# EAGLE design Hooly_2.023 (EAGLE 8.5.1)
SHT31 con connettore Tutto 1206 anzichè 0603 Con regolatore all'ingresso Variante Con quarzo non SMD Partitore a VBATT per misurare livello batteria
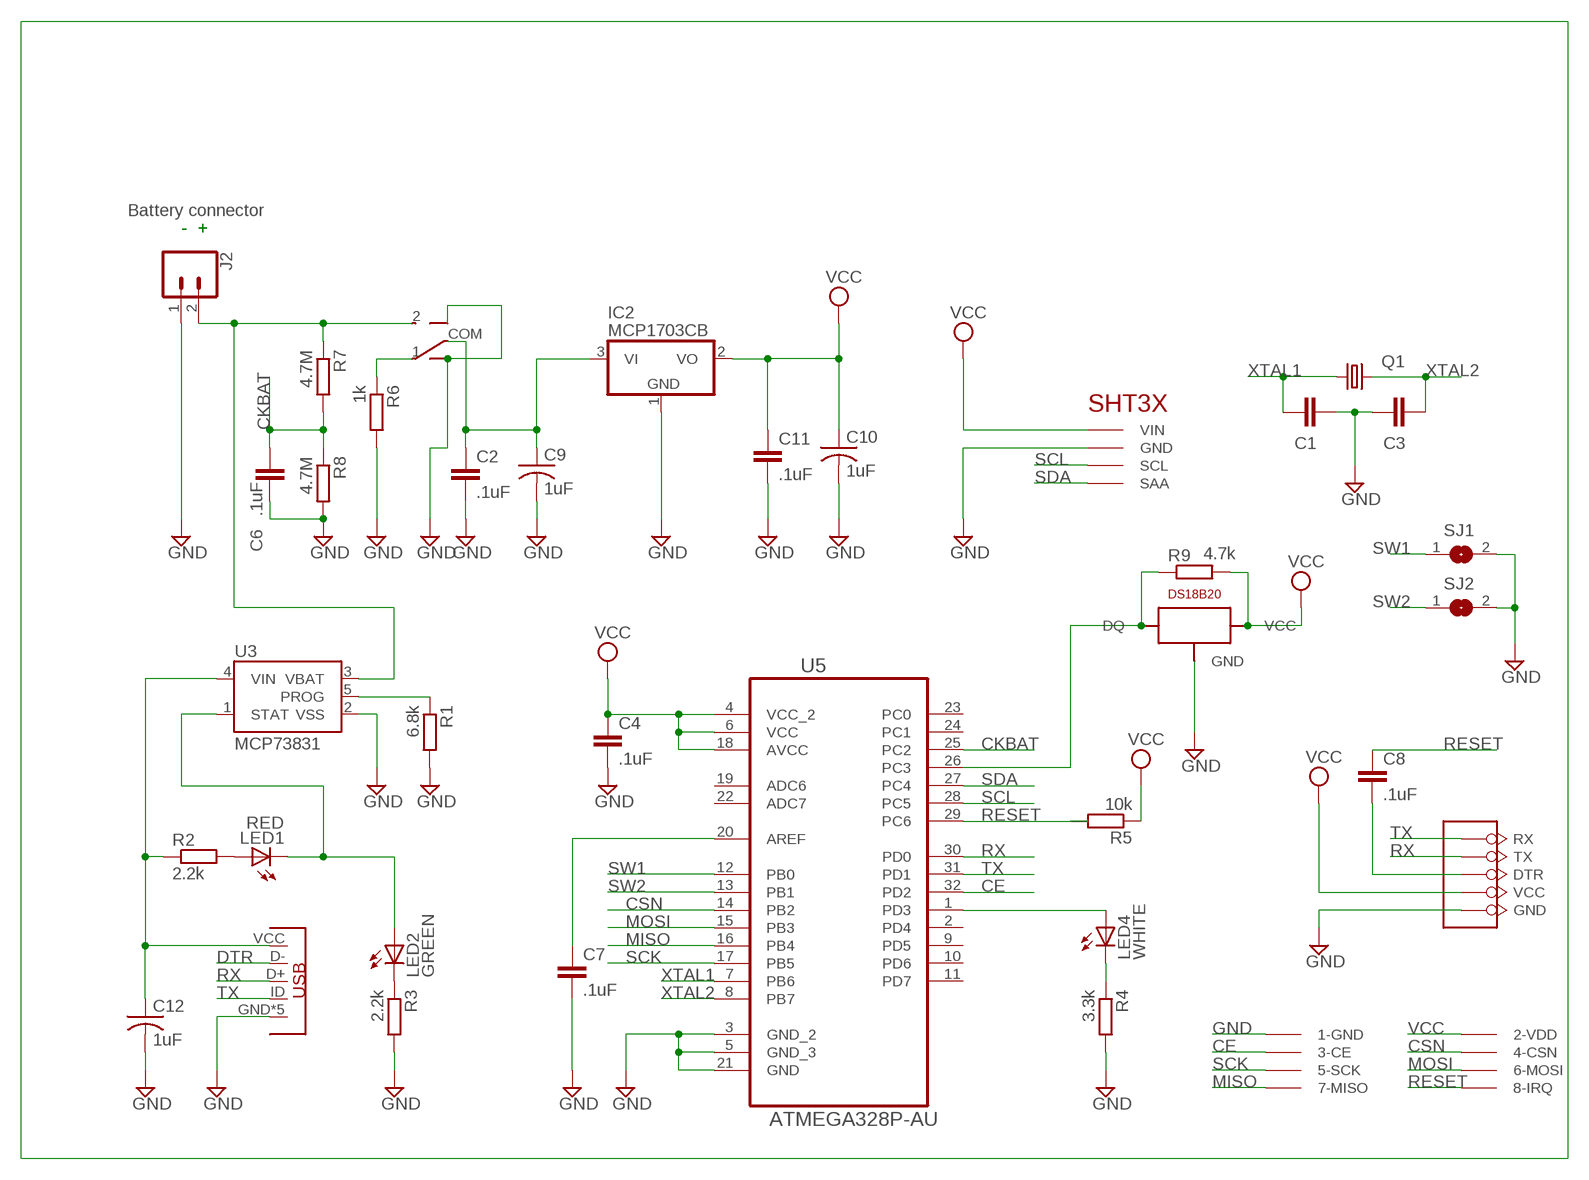
[diagram p0: schematic, sheet 1]

## Parts
C1  C-EUC0603K  [C0603K]
C2  .1uF  C-EUC0603  [C0603]
C3  C-EUC0603K  [C0603K]
C4  .1uF  C-EUC0603  [C0603]
C6  .1uF  C-EUC0603  [C0603]
C7  .1uF  C-EUC0603  [C0603]
C8  .1uF  C-EUC0603  [C0603]
C9  1uF  C-USC1206K  [C1206K]
C10  1uF  C-USC1206K  [C1206K]
C11  .1uF  C-EUC0603  [C0603]
C12  1uF  C-USC1206K  [C1206K]
IC2  MCP1703CB  [SOT23]
J2  CONN_02  [1X02]
LED1  RED  LEDCHIPLED_0603  [CHIPLED_0603]
LED2  GREEN  LEDCHIPLED_0603  [CHIPLED_0603]
LED4  WHITE  LEDCHIPLED_0603  [CHIPLED_0603]
Q1  KX-9B  [5.0X3.2_2]
R1  6.8k  R-EU_R0603  [R0603]
R2  2.2k  R-EU_R0603  [R0603]
R3  2.2k  R-EU_R0603  [R0603]
R4  3.3k  R-EU_R0603  [R0603]
R5  10k  R-EU_R0603  [R0603]
R6  1k  R-EU_R0603  [R0603]
R7  4.7M  R-EU_R0603  [R0603]
R8  4.7M  R-EU_R0603  [R0603]
R9  4.7k  R-EU_R0603  [R0603]
SJ1  SJ  [SJ]
SJ2  SJ  [SJ]
U3  MCP73831  [SOT23-5]
U5  ATMEGA328P-AU  [QFP80P900X900X120-32N]
U$1  SHT3XLARGE  [MYSHT3X]
U$2  MYSWITCH2MM  [MYSWITCH]
U$3  MYDS18B20  [MYDS18B20]
U$4  MYNRF24L01SOCKET  [MYNRF24L01SOCKET]
U$5  FTDI232  [FTDI232]
U$7  MYMICROUSB  [MYMICROUSB]

## Nets
CE: U5.32(PD2) U$4.CE(3-CE)
CKBAT: C6.1 R7.2 R8.1 U5.25(PC2)
CSN: U5.14(PB2) U$4.CSN(4-CSN)
DTR: C8.2 U$5.DTR U$7.D-
GND: C1.2 C2.2 C3.1 C4.2 C6.2 C7.2 C9.2 C10.2 C11.2 C12.2 IC2.1(GND) J2.1 R1.2 R3.2 R4.2 R6.2 R8.2 SJ1.2 SJ2.2 U3.2(VSS) U5.3(GND_2) U5.5(GND_3) U5.21(GND) U$1.GND U$2.GND1 U$2.GND2 U$3.GND U$4.GND(1-GND) U$5.GND U$7.GND U$7.P$6(GND) U$7.P$7(GND) U$7.P$8(GND) U$7.P$9(GND)
MISO: U5.16(PB4) U$4.MISO(7-MISO)
MOSI: U5.15(PB3) U$4.MOSI(6-MOSI)
N$2: C2.1 C9.1 IC2.3(VI) U$2.COM
N$3: LED4.A U5.1(PD3)
N$5: LED1.A R2.2
N$7: LED2.C R3.1
N$8: LED1.C LED2.A U3.1(STAT)
N$9: R6.1 U$2.1
N$10: R1.1 U3.5(PROG)
N$12: C7.1 U5.20(AREF)
N$13: R9.1 U5.26(PC3) U$3.DQ
N$14: LED4.C R4.1
RESET: C8.1 R5.2 U5.29(PC6) U$4.IRQ(8-IRQ)
RX: U5.30(PD0) U$5.TX U$7.D+
SCK: U5.17(PB5) U$4.SCK(5-SCK)
SCL: U5.28(PC5) U$1.SCL
SDA: U5.27(PC4) U$1.SAA
SW1: SJ1.1 U5.12(PB0)
SW2: SJ2.1 U5.13(PB1)
TX: U5.31(PD1) U$5.RX U$7.ID
VBATT: J2.2 R7.1 U3.3(VBAT) U$2.2
VCC: C4.1 C10.1 C11.1 IC2.2(VO) R5.1 R9.2 U5.4(VCC_2) U5.6(VCC) U5.18(AVCC) U$1.VIN U$3.VCC U$4.VDD(2-VDD) U$5.VCC
VUSB: C12.1 R2.1 U3.4(VIN) U$7.VCC
XTAL1: C1.1 Q1.1 U5.7(PB6)
XTAL2: C3.2 Q1.2 U5.8(PB7)
Unconnected: U5.2(PD4) U5.9(PD5) U5.10(PD6) U5.11(PD7) U5.19(ADC6) U5.22(ADC7) U5.23(PC0) U5.24(PC1)

## Notes on the sheet
- Battery connector
- -  + | -  + | -  + | -  + | -  +

## Library data of the parts
C1 C3 = rcl:C-EU: CAPACITOR, European symbol; SPICEPREFIX: C
C2 C4 C6-C8 C11 = resistor:C-EU: CAPACITOR, European symbol
C9 C10 C12 = resistor:C-US: CAPACITOR, American symbol
IC2 = linear:MCP1703: 250 mA, 16V, Low Quiescent Current LDO Regulator Source: http://ww1.microchip.com/downloads/en/DeviceDoc/22049b.pdf
J2 = SparkFun-Connectors:CONN_02: Multi connection point. Often used as Generic Header-pin footprint for 0.1 inch spaced/style header connections On any of the 0.1 inch spaced packages, you can populate with these: Break Away Headers - Straight <https://www.sparkfun.com/products/116> (PRT-00116) Break Away Male Headers - Right Angle <https://www.sparkfun.com/products/553> (PRT-00553) Female Headers <https://www.sparkfun.com/products/115> (PRT-00115) Break Away Headers - Machine Pin <https://www.sparkfun.com/products/117> (PRT-00117) Break Away Female Headers - Swiss Machine Pin <https://www.sparkfun.com/products/743> (PRT-00743) For SCREWTERMINALS and SPRING TERMINALS visit here: Screw Terimnals on SparkFun.com <https://www.sparkfun.com/search/results?term=Screw+Terminals> (5mm/3.5mm/2.54mm spacing) This device is also useful as a general connection point to wire up your design to another part of your project. Our various solder wires solder well into these plated through hole pads. Hook-Up Wire - Assortment (Stranded, 22 AWG) <https://www.sparkfun.com/products/11375> (PRT-11375) Hook-Up Wire - Assortment (Solid Core, 22 AWG) <https://www.sparkfun.com/products/11367> (PRT-11367) View the entire wire category on our website here <https://www.sparkfun.com/categories/141> Special notes: Molex polarized connector foot print use with: PRT-08233 with associated crimp pins and housings. 2.54_SCREWTERM for use with PRT-10571. 3.5mm Screw Terminal footprints for PRT-08084 5mm Screw Terminal footprints for use with PRT-08432
LED1 LED2 LED4 = led:LED: LED OSRAM: - CHIPLED LG R971, LG N971, LY N971, LG Q971, LY Q971, LO R971, LY R971 LH N974, LH R974 LS Q976, LO Q976, LY Q976 LO Q996 - Hyper CHIPLED LW Q18S LB Q993, LB Q99A, LB R99A - SideLED LS A670, LO A670, LY A670, LG A670, LP A670 LB A673, LV A673, LT A673, LW A673 LH A674 LY A675 LS A676, LA A676, LO A676, LY A676, LW A676 LS A679, LY A679, LG A679 - Hyper Micro SIDELED® LS Y876, LA Y876, LO Y876, LY Y876 LT Y87S - SmartLED LW L88C, LW L88S LB L89C, LB L89S, LG L890 LS L89K, LO L89K, LY L89K LS L896, LA L896, LO L896, LY L896 - TOPLED LS T670, LO T670, LY T670, LG T670, LP T670 LSG T670, LSP T670, LSY T670, LOP T670, LYG T670 LG T671, LOG T671, LSG T671 LB T673, LV T673, LT T673, LW T673 LH T674 LS T676, LA T676, LO T676, LY T676, LB T676, LH T676, LSB T676, LW T676 LB T67C, LV T67C, LT T67C, LS T67K, LO T67K, LY T67K, LW E67C LS E67B, LA E67B, LO E67B, LY E67B, LB E67C, LV E67C, LT E67C LW T67C LS T679, LY T679, LG T679 LS T770, LO T770, LY T770, LG T770, LP T770 LB T773, LV T773, LT T773, LW T773 LH T774 LS E675, LA E675, LY E675, LS T675 LS T776, LA T776, LO T776, LY T776, LB T776 LHGB T686 LT T68C, LB T68C - Hyper Mini TOPLED® LB M676 - Mini TOPLED Santana® LG M470 LS M47K, LO M47K, LY M47K Source: http://www.osram.convergy.de LUXEON: - LUMILED® LXK2-PW12-R00, LXK2-PW12-S00, LXK2-PW14-U00, LXK2-PW14-V00 LXK2-PM12-R00, LXK2-PM12-S00, LXK2-PM14-U00 LXK2-PE12-Q00, LXK2-PE12-R00, LXK2-PE12-S00, LXK2-PE14-T00, LXK2-PE14-U00 LXK2-PB12-K00, LXK2-PB12-L00, LXK2-PB12-M00, LXK2-PB14-N00, LXK2-PB14-P00, LXK2-PB14-Q00 LXK2-PR12-L00, LXK2-PR12-M00, LXK2-PR14-Q00, LXK2-PR14-R00 LXK2-PD12-Q00, LXK2-PD12-R00, LXK2-PD12-S00 LXK2-PH12-R00, LXK2-PH12-S00 LXK2-PL12-P00, LXK2-PL12-Q00, LXK2-PL12-R00 Source: www.luxeon.com KINGBRIGHT: KA-3528ASYC Source: www.kingbright.com
Q1 = crystal-geyer_V1_0:KX: Quartz Crystals (MHz) SMD: KX - Serie Model Size l/w/h [mm] Frequency Range Frequency Stability Temp. Range [°C] Load Capacitance AECQ 200 availabel Datasheet KX-4 KX-5 KX-6 KX-7 KX-9A KX-9B KX-12A KX-12B KX-13 KX-20 KX-K KX-KS 1.6/1.2/0.3 2.0/1.6/0.45 2.5/2.0/0.55 3.2/2.5/0.8 5.0/3.2/1.0 5.0/3.2/1.1 6.0/3.5/1.1 6.0/3.5/1.0 7.0/5.0 /1.3 11.6/5.5/1.6 12.3/4.5/4.2 12.3/4.5/3.2 24.0 ~ 80.0 MHz 16.0 ~ 80.0 MHz 12.0 ~ 80.0 MHz 8.0 ~ 60.0 MHz 7,68 ~ 300,0 MHz 8,0 ~ 50,0 MHz 8,0 ~ 150,0 MHz 8,0 ~ 50,0 MHz 6,0 ~ 160,0 MHz 3,579 ~ 25,0 MHz 3,579 ~ 70,0 MHz 3,579 ~ 70,0 MHz ±10 … ±50ppm ±10 … ±50ppm ±10 … ±50ppm ±10 … ±50ppm ±10 … ±50ppm ±10 … ±50ppm ±10 … ±50ppm ±10 … ±50ppm ±10 … ±50ppm ±50ppm ±10 … ±50ppm ±10 … ±50ppm (*) -40°C …+85°C (*) -40°C …+125°C (*) -40°C …+125°C (*) -40°C …+125°C (*) -40°C …+105°C (*) -40°C …+105°C (*) -40°C …+125°C (*) -40°C …+105°C (*) -40°C …+105°C (*) -40°C …+105°C (*) -40°C …+85°C (*) -40°C …+85°C 8, 8…16 8, 8…16 10, 8…16 12, 7…20 16, 10…20 16, 10…20 16, 10…20 16, 12…20 16, 12…20 16, 12…20 16, 12…30 16, 12…30 - yes yes yes - - - - - - - - KX-4.pdf <http://www.geyer-electronic.de/uploads/tx_userartikelfrequenz/GEYER-KX-4.pdf> KX-5.pdf <http://www.geyer-electronic.de/uploads/tx_userartikelfrequenz/GEYER-KX-5.pdf> KX-6.pdf <http://www.geyer-electronic.de/uploads/tx_userartikelfrequenz/GEYER-KX-6.pdf> KX-7.pdf <http://www.geyer-electronic.de/uploads/tx_userartikelfrequenz/GEYER-KX-7.pdf> KX-9A.pdf <http://www.geyer-electronic.de/uploads/tx_userartikelfrequenz/GEYER-KX-9A.pdf> KX-9B.pdf <http://www.geyer-electronic.de/uploads/tx_userartikelfrequenz/GEYER-KX-9B.pdf> KX-12A.pdf <http://www.geyer-electronic.de/uploads/tx_userartikelfrequenz/GEYER-KX-12A.pdf> KX-12B.pdf <http://www.geyer-electronic.de/uploads/tx_userartikelfrequenz/GEYER-KX-12B.pdf> KX-13.pdf <http://www.geyer-electronic.de/uploads/tx_userartikelfrequenz/GEYER-KX-13.pdf> KX-20.pdf <http://www.geyer-electronic.de/uploads/tx_userartikelfrequenz/GEYER-KX-20.pdf> KX-K.pdf <http://www.geyer-electronic.de/uploads/tx_userartikelfrequenz/GEYER-KX-K.pdf> KX-KS.pdf <http://www.geyer-electronic.de/uploads/tx_userartikelfrequenz/GEYER-KX-KS.pdf> <http://www.geyer-electronic.de/fileadmin/template/img/logo-geyer-electronic.png> Details see: http://www.geyer-electronic.de/Frequenz-Produkte.9.0.html Created 2016-06-07, Hans Locher 2016 (C) Geyer Quartz Technology KX4,KX5,KX6,KX7,KX9A,KX9B,KX12A,KX12B,KX13,KX20,KXK,KXKS;1612;2016;2520;3225;5032;6035;7050;11655;12345;1,6x1,2;2,0x1,6;2,5x2,0;3,2x2,5;5,0x3,2;6,0x3,5;7,0x5,0;11,6x5,5;12,3x4,5;12,3x4,5;1.6x1.2;2.0x1.6;2.5x2.0;3.2x2.5;5.0x3.2;6.0x3.5;7.0x5.0;11.6x5.5;12.3x4.5;12.3x4.5;
R1-R9 = rcl:R-EU_: RESISTOR, European symbol
SJ1 SJ2 = jumper:SJ: SMD solder JUMPER
U3 = SparkFun-IC-Power:MCP73831: MCP73831T Li-Ion, Li-Pol Controller Miniature single cell, fully integrated Li-Ion, Li-polymer charge management controller Datasheet <http://ww1.microchip.com/downloads/en/DeviceDoc/20001984g.pdf> SparkFun Products: SparkFun ESP32 Thing <https://www.sparkfun.com/products/13907> SparkFun 9DoF Razor IMU M0 <https://www.sparkfun.com/products/14001>; PROD_ID: IC-09995
U5 = Atmel_By_element14_Batch_1-00:ATMEGA328P-AU: 8-bit Microcontroller with In-System Programmable Flash; MPN: ATMEGA328P-AU; OC_FARNELL: 1715486; OC_NEWARK: 14R4631; PACKAGE: TQFP-32; SUPPLIER: Atmel
U$1 = My_library:SHT3X
U$2 = My_library:MYSWITCH2MM: Slide switch 2mm pitch
U$3 = My_library:MYDS18B20
U$4 = My_library:MYNRF24L01SOCKET
U$5 = My_library:FTDI232
U$7 = My_library:MYMICROUSB: MicroUSB connectori SMD https://it.aliexpress.com/item/100pcs-Micro-USB-Connector-5pin-Seat-Jack-Micro-usb-Four-legs-5P-Inserting-plate-seat-MIni/32708224969.html?spm=a2g0s.13010208.99999999.262.eblQws

## Net classes
0 default: clearance 0.381 mm

## Board
Come 2.022, f.to 0603
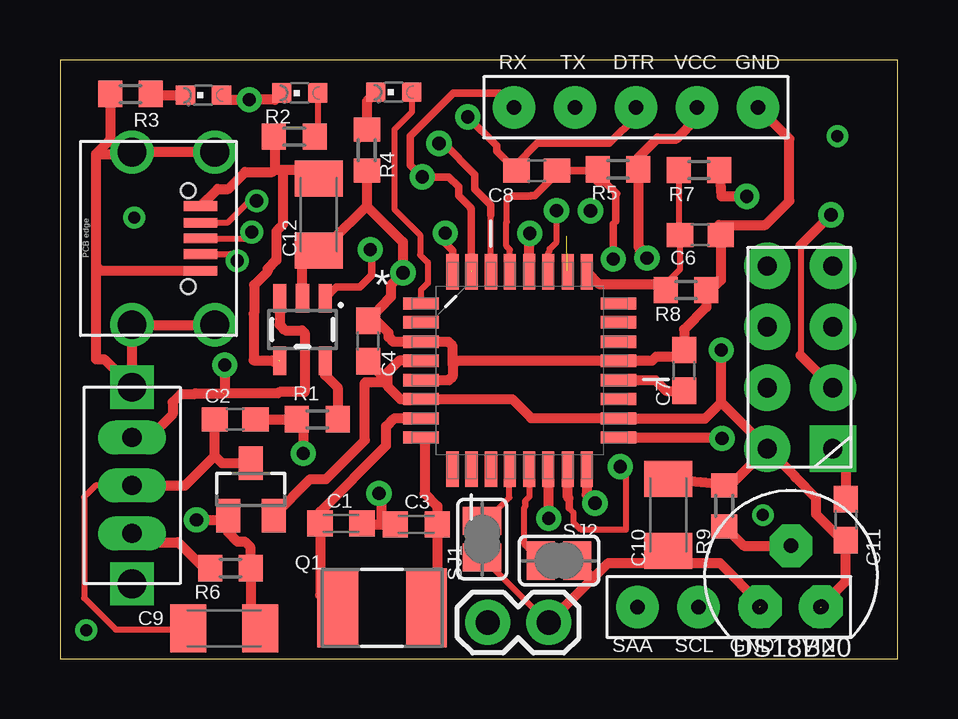
[diagram p1: board, top side]
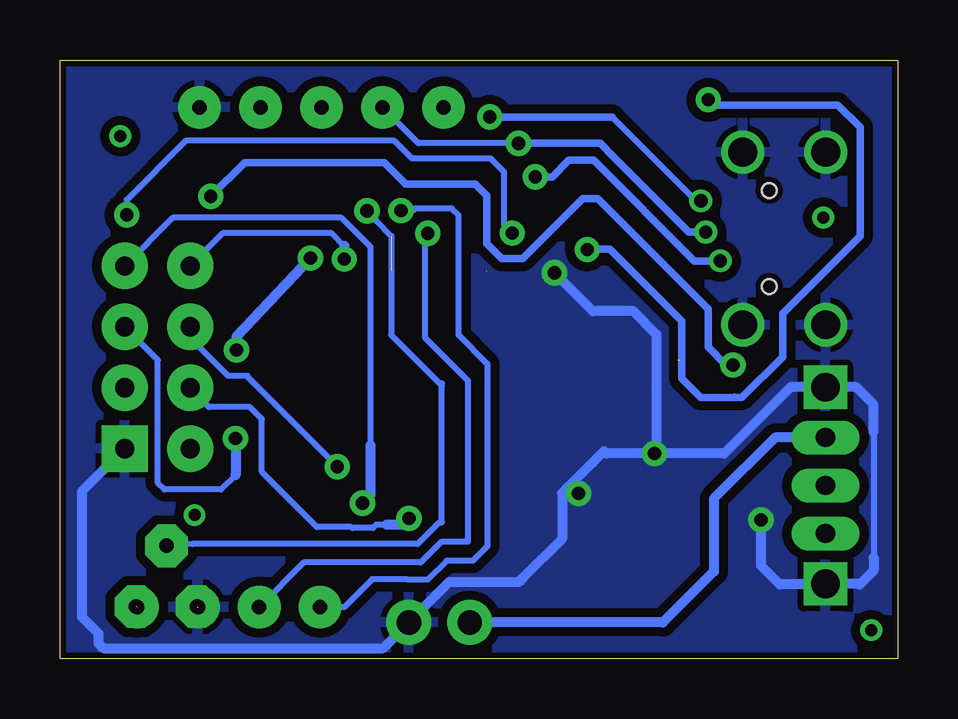
[diagram p2: board, bottom side, seen from below]

Size 34.9 x 24.98 mm. Coordinates in mm from the lower left corner, seen from the top.
Outline: 0,0 34.9,0 34.9,24.98 0,24.98 0,0
Copper layers (1*16): Top 0.035mm / dielectric 1.5mm / Bottom 0.035mm
Design rules "default *": minimum track width 6mil, minimum drill 0.35mm, track to track 7mil, track to pad 10mil, pad to pad 6mil, via to via 6mil, smd to smd 6mil, copper to edge 10mil, drill to drill 2mil, minimum pad ring 10mil, minimum via ring 8mil, stop-mask expansion 4mil, vias tented up to drill 0mil, thermal gap 10mil

### Footprints (pad centres in the part's own frame; a part is rotated, then mirrored left to right if it is on the bottom)
C0603K = smd 1.05 x 1.08: 1 -0.875,0; 2 0.875,0
C0603 = smd 1.1 x 1: 1 -0.85,0; 2 0.85,0
C1206K = smd 1.5 x 2: 1 -1.5,0; 2 1.5,0
SOT23 = smd 1 x 1.4: 1 -0.95,-1.1; 2 0.95,-1.1; 3 0,1.1
1X02 = drill 1.016 pad 1.88: 1 0,0; 2 2.54,0
CHIPLED_0603 = smd 0.8 x 0.8: A 0,-0.75; C 0,0.75
5.0X3.2_2 = smd 1.7 x 3.3: 1 -1.85,0; 2 1.85,0
R0603 = smd 1 x 1.1: 1 -0.85,0; 2 0.85,0
SJ = smd 1.168 x 1.6: 1 -0.762,0; 2 0.762,0
SOT23-5 = smd 0.55 x 1.2: 1 -0.95,-1.3; 2 0,-1.3; 3 0.95,-1.3; 4 0.95,1.3; 5 -0.95,1.3
QFP80P900X900X120-32N = smd 1.473 x 0.508: 1 -4.115,2.794; 2 -4.115,2.007; 3 -4.115,1.194; 4 -4.115,0.406; 5 -4.115,-0.406; 6 -4.115,-1.194; 7 -4.115,-2.007; 8 -4.115,-2.794; 17 4.115,-2.794; 18 4.115,-2.007; 19 4.115,-1.194; 20 4.115,-0.406; 21 4.115,0.406; 22 4.115,1.194; 23 4.115,2.007; 24 4.115,2.794 | smd 0.508 x 1.473: 9 -2.794,-4.115; 10 -2.007,-4.115; 11 -1.194,-4.115; 12 -0.406,-4.115; 13 0.406,-4.115; 14 1.194,-4.115; 15 2.007,-4.115; 16 2.794,-4.115; 25 2.794,4.115; 26 2.007,4.115; 27 1.194,4.115; 28 0.406,4.115; 29 -0.406,4.115; 30 -1.194,4.115; 31 -2.007,4.115; 32 -2.794,4.115
MYSHT3X = drill 0.6 pad 1.778: GND -3.81,0; SAA 1.27,0; SCL -1.27,0; VIN -6.35,0
MYSWITCH = drill 0.8 pad 1.422 long: 1 -2,0; 2 2,0; COM 0,0 | drill 1.2 square: GND1 -4.1,0; GND2 4.1,0
MYDS18B20 = drill 0.6 pad 1.778 octagon: DQ 0,-1.27; GND 1.27,1.27; VCC -1.27,1.27
MYNRF24L01SOCKET = drill 0.8 pad 1.93: CE 0,2.54; CSN -2.731,2.54; IRQ -2.731,7.62; MISO 0,7.62; MOSI -2.731,5.08; SCK 0,5.08; VDD -2.731,0 | drill 0.8 pad 1.93 square: GND 0,0
FTDI232 = drill 0.6 pad 1.778: DTR 3.81,0; GND 8.89,0; RX -1.27,0; TX 1.27,0; VCC 6.35,0
MYMICROUSB = smd 0.4 x 1.4: D+ 0,5; D- -0.65,5; GND 1.35,5; ID 0.65,5; VCC -1.35,5 | drill 1.2: P$6 -3.6,2.15; P$7 3.6,2.15; P$8 3.6,5.6; P$9 -3.6,5.6 | hole 0.6: -2,4.5; 2,4.5

### Placement (x,y rotation side)
C1  11.71,5.65 0 top
C2  7.3,10 0 top
C3  14.85,5.62 0 top
C4  12.83,13.26 90 top
C6  26.68,17.68 0 top
C7  26.01,12.03 90 top
C8  19.86,20.36 180 top
C9  6.84,1.27 0 top
C10  25.33,6.01 270 top
C11  32.75,5.81 90 top
C12  10.78,18.54 270 top
IC2  7.95,7.07 0 top
J2  20.36,1.52 180 top
LED1  10,23.6 90 top
LED2  5.98,23.51 90 top
LED4  13.91,23.63 90 top
Q1  13.42,2.13 0 top
R1  10.72,9.99 180 top
R2  9.76,21.78 0 top
R3  2.94,23.56 180 top
R4  12.79,21.22 270 top
R5  23.25,20.42 180 top
R6  7.1,3.79 0 top
R7  26.62,20.38 180 top
R8  26.09,15.38 0 top
R9  27.68,6.38 90 top
SJ1  17.59,5 270 top
SJ2  20.79,4.1 0 top
U3  10.1,13.74 180 top
U5  19.15,12.03 0 top
U$1  25.33,2.17 180 top
U$2  3,7.24 90 top
U$3  30.46,3.45 180 top
U$4  32.2,8.77 0 top
U$5  20.19,23 0 top
U$7  0.85,17.54 270 top

### Tracks (layer width: path | path; a pad name or v marks a point on that pad's centre or on a via)
CE  (via drill 0.55 pad 1.05)
  Top 0.152: 16.38,16.07 U5.32
  Top 0.254: 30.86,17.25 30.86,12.66
  Top 0.305: v16.06,17.75 16.06,17.34 16.36,17.04 U5.32
  Top 0.406: U$4.CE 30.86,12.66 | v32.12,18.52 30.86,17.25
  Bottom 0.254: v16.06,17.75 16.39,18.09 16.39,20.3 16.96,20.87 20.22,20.87 20.96,21.61 29.66,21.61 32.12,19.14 v32.12,18.52
CKBAT
  Top 0.152: 25.22,15.64 R8.1
  Top 0.254: C6.1 25.83,17.4 | 25.83,17.4 25.83,16.25 25.22,15.64 | R7.2 25.77,17.46 25.83,17.4
  Top 0.406: U5.25 22.45,15.64 25.22,15.64 | 25.33,15.48 R8.1 | 25.79,20.36 R7.2
CSN  (via drill 0.55 pad 1.05)
  Top 0.152: U5.14 20.36,7.9
  Top 0.406: U5.14 20.35,6.38 v20.36,5.86
  Bottom 0.254: 21.29,5.6 21.73,5.6 21.86,5.47 22.72,5.47 22.76,5.5 24.19,5.5 26.49,7.8 26.49,10 26.99,10.5 28.69,10.5 29.47,11.28 U$4.CSN
  Bottom 0.406: v20.36,5.86 20.52,5.6 21.29,5.6
DTR  (via drill 0.55, 0.55 pad 1.05)
  Top 0.254: 6.39,18.2 6.99,18.2 7.89,19.1 v8.19,19.1
  Top 0.305: U$5.DTR 24,22.61 22.89,21.5 19.89,21.5 19.01,20.62 C8.2 18.19,21.18 18.19,21.4 v16.99,22.6 | U$7.D- 6.37,18.19 6.39,18.2
  Bottom 0.254: 11.89,22.6 8.39,19.1 v8.19,19.1
  Bottom 0.305: v16.99,22.6 11.89,22.6
GND  (via drill 0.55 pad 1.05)  (1 unrouted)
  Top 0.152: 10.38,16.84 10.66,16.97 C12.2
  Top 0.254: IC2.1 7,6.16 | 10.13,8.35 v10.13,8.57 | SJ2.2 22.22,3.44 22.22,3.38 | SJ1.2 20.31,1.52 J2.1
  Top 0.406: 16.36,12.29 16.36,11.78 16.21,11.63 U5.5 | 16.36,12.29 16.36,13.05 16.18,13.23 U5.3 13.89,13.23 13.69,13.43 13.69,13.6 13.19,14.11 C4.2 13.33,14.64 13.79,15.1 13.79,15.6 v14.29,16.1 14.29,17.39 12.79,18.89 | 16.36,12.29 16.51,12.44 U5.21 24.67,12.44 24.84,12.61 25.74,12.61 C7.2 26.01,13.74 26.94,14.67 26.94,15.2 | 9.76,10.1 R1.2 | R1.2 10.13,9.73 v10.13,8.57 | 7.67,4.08 7.92,3.83 | 7.92,3.83 R6.2 7.95,1.28 C9.2 | 27.03,15.48 R8.2 26.94,15.2 | v5.69,5.8 6.89,5.8 7.03,5.94 IC2.1 7,5.29 7.39,4.9 7.69,4.9 7.92,4.68 7.92,3.83 | C2.2 R1.2 | R3.2 2.09,21.65 1.49,21.05 | 1.49,21.05 1.49,16.4 | 1.49,16.4 1.49,12.5 1.84,12.5 U$2.GND2 3,13.53 U$7.P$7 U$7.P$8 | U$5.GND 30.39,21.69 30.39,19.1 29.39,18.1 27.46,18.1 C6.2 27.53,15.8 26.94,15.2 | C10.2 25.39,4.27 25.13,4 22.84,4 22.22,3.38 J2.1 | C1.2 12.62,5.62 13.39,5.62 | 13.39,5.62 C3.1 | v13.29,6.9 13.39,6.8 13.39,5.62 | C10.2 25.54,4.3 | U$7.GND 1.71,16.19 1.49,16.4 | 1.49,21.05 2.92,21.05 U$7.P$6 U$7.P$9 | C10.2 25.84,4 27.49,4 29.19,2.31 U$3.GND | U$4.GND 32.75,8.22 C11.2 | R4.2 12.79,18.89 | 12.79,18.89 11.29,17.4 11.29,17.2 11.12,17.04 C12.2 | U3.2 10.09,16.41 10.66,16.97
  Bottom 0.152: 12.33,8.57 12.7,8.2
  Bottom 0.254: 2.89,3.14 U$2.GND1 | 1,9.49 1,4.23
  Bottom 0.406: 13.69,7.2 12.7,8.2 12.23,8.66 12.14,8.57 v10.13,8.57 | 13.69,7.2 13.98,6.91 13.98,5.01 15.63,3.36 | 15.63,3.37 15.63,3.36 | 15.63,3.36 15.79,3.2 18.69,3.2 J2.1 | J2.1 | 1,9.49 1,10.61 1.72,11.34 U$2.GND2 4.46,11.34 7.23,8.57 v10.13,8.57 | 1,4.23 1,3.7 1.59,3.1 1.62,3.14 2.89,3.14 4.86,3.14 4.89,3.1 5.69,3.9 v5.69,5.8 | v14.29,16.1 12.69,14.5 11.01,14.5 10.05,13.54 10.05,8.65 v10.13,8.57 | v13.29,6.9 13.59,7.2 13.69,7.2 | U$4.GND 33.99,6.98 33.99,1.76 33.3,1.07 33.3,0.67 33.09,0.46 21.44,0.46 J2.1
  pour Bottom: 34.59,24.5 34.59,-0.1 0.39,0.2 0.29,24.6
MISO  (via drill 0.55 pad 1.05)
  Top 0.152: U5.16 22.02,7.85
  Top 0.406: U5.16 21.95,6.85 v22.29,6.5
  Bottom 0.254: 21.97,8.92 21.97,17.19 23.18,18.4 30.19,18.4 U$4.MISO
  Bottom 0.406: 21.97,8.92 21.97,6.82 v22.29,6.5
MOSI  (via drill 0.55 pad 1.05)
  Top 0.152: U5.15 21.31,7.77
  Top 0.254: 21.21,6.29 21.39,6.11 21.39,5.7 21.68,5.41 22.35,5.41 22.36,5.4 23.59,5.4 23.59,7.77 v23.34,8.02
  Top 0.305: 21.16,6.75 21.21,6.7 21.21,6.29
  Top 0.406: U5.15 21.16,6.75 21.19,6.71
  Bottom 0.254: U$4.MOSI 29.47,13.38 27.89,11.8 27.09,11.8 27.09,11.77 v23.34,8.02
N$2
  Top 0.254: U$2.COM 1.48,7.24 1.01,6.76 1.01,2.55 2.32,1.23 4.9,1.23 C9.1
  Top 0.406: U$2.COM 5.21,7.24 6.45,8.47 | 6.45,8.47 C2.1 | 6.45,8.47 6.74,8.17 IC2.3
N$3
  Top 0.254: LED4.A 14.66,22.8 13.93,22.08 13.93,18.75 15,17.68 15,16.85 15.32,16.53 15.32,15.67 15.04,15.39 U5.1
N$4  (via drill 0.5)
  other vias: 1.09,1.2
N$5
  Top 0.152: 10.7,22.27 10.64,21.91 | 10.64,21.91 R2.2 | 10.75,22.02 10.64,21.91
  Top 0.254: LED1.A 10.75,21.91 R2.2
N$6  (via drill 0.5)
  other vias: 3.09,18.4
N$7
  Top 0.152: R3.1 3.84,23.11
  Top 0.406: R3.1 3.84,23.51 LED2.C
N$8  (via drill 0.55 pad 1.05)
  Top 0.152: 9.03,23.32 LED1.C
  Top 0.254: 11.13,14.74 U3.1
  Top 0.305: v12.93,17.08 12.99,17.02 12.99,16 12.49,15.5 11.52,15.5 U3.1
  Top 0.406: LED2.A 6.91,23.32 v7.88,23.32 8.96,23.32 LED1.C
  Bottom 0.305: v7.88,23.32 7.67,23.1 2.49,23.1 1.56,22.18 1.56,17.63 4.79,14.4 4.79,12.6 6.49,10.9 8.19,10.9 8.99,11.7 8.99,14.1 11.99,17.1 12.91,17.1 v12.93,17.08
N$9
  Top 0.406: U$2.1 3.37,4.86 4.92,4.86 5.99,3.79 R6.1
N$10
  Top 0.406: R1.1 11.57,11.32 11.05,11.84 U3.5
N$11  (via drill 0.5)
  other vias: 32.39,21.8
N$12
  Top 0.152: 23.36,11.72 U5.20
  Top 0.406: U5.20 24.81,11.63 25.26,11.18 C7.1
N$13  (via drill 0.55 pad 1.05)  (1 unrouted)
  Top 0.254: U5.26 21.19,16.18
  Top 0.406: 21.1,16.2 U5.26 | R9.1 28.49,4.72 U$3.DQ
  Bottom 0.254: 18.99,11.4 18.99,5.7 19.09,5.7 20,4.79 29.38,4.79 U$3.DQ | 18.99,11.4 18.99,11.49 | 18.99,11.4 21.1,13.52 21.09,13.53 21.09,17.64 21.72,18.27 21.72,18.31 v22.1,18.69
N$14
  Top 0.152: 12.43,21.61 R4.1
  Top 0.254: 12.46,21.64 12.43,21.61
  Top 0.406: LED4.C 12.78,23.26 R4.1
N$15  (via drill 0.5)
  other vias: 29.29,6
RESET  (via drill 0.55 pad 1.05)
  Top 0.254: R5.2 22.4,19.89 22.33,19.89 | U5.29 18.75,17.07 18.6,17.21 18.6,18.21 18.62,18.23 18.62,19.13 18.64,19.15
  Top 0.305: R5.2 22.35,20.36 20.79,20.36 | 20.79,20.36 C8.1 | 20.79,20 20.79,20.1 | 20.79,20.1 20.79,20.36 | 20.79,20.1 20.56,20.1 19.78,19.32 19.61,19.32 19.59,19.3 18.79,19.3 18.64,19.15 | 22.4,19.89 22.7,19.89 23.19,19.4 23.16,19.37 23.16,18.25 23.05,18.14 v23.05,16.68
  Bottom 0.254: v23.05,16.68 23.19,16.81 | 23.05,17.22 23.58,17.75 28.11,17.75 U$4.IRQ
  Bottom 0.406: v23.05,16.68 23.05,17.22
RX  (via drill 0.55, 0.55 pad 1.05)
  Top 0.254: 17.88,16.22 U5.30 17.96,18.5 17.96,18.65 | U$7.D+ 7.72,17.54 v7.99,17.8
  Top 0.305: 17.96,18.74 17.96,18.5 | 17.96,18.65 17.96,18.94 17.29,19.6 17.29,20.2 15.99,21.5 v15.79,21.5 | U$7.D+ 6.16,17.54 6.19,17.5
  Bottom 0.254: v15.79,21.5 19.96,21.5 U$5.TX
  Bottom 0.305: v15.79,21.5 12.39,21.5 11.84,20.95 8.69,17.8 v7.99,17.8
SCK  (via drill 0.55 pad 1.05)
  Top 0.152: 27.54,9.24 v27.58,9.2
  Top 0.406: U5.17 27.54,9.24
  Bottom 0.254: 27.58,7.67 28.19,7.06 30.54,7.06 30.82,7.34 30.82,12.47 U$4.SCK
  Bottom 0.406: v27.58,9.2 27.58,7.67
SCL  (via drill 0.55 pad 1.05)
  Top 0.406: 19.59,16.18 U5.28 19.56,17.63 v19.58,17.75
  Bottom 0.254: U$1.SCL 24.74,4.02 19.87,4.02 18.99,4.9 17.89,4.9 17.89,11.6 19.69,13.4 19.69,17.74 v19.58,17.75
SDA  (via drill 0.55 pad 1.05)
  Top 0.152: 20.32,16.17 U5.27
  Top 0.254: U5.27 20.35,16.96 20.4,17.01 20.4,17.09 20.69,17.39 v20.69,18.7
  Bottom 0.254: 21.89,3.33 20.45,3.33 20.42,3.3 19.59,3.3 18.79,4.1 17.69,4.1 17.09,4.7 17.09,12.3 18.29,13.5 18.29,18.5 18.57,18.78 20.11,18.78 20.19,18.7 v20.69,18.7 | 21.89,3.33 | 21.89,3.33 23.06,2.17 U$1.SAA
SW1
  Top 0.254: 18.25,5.76 SJ1.1 17.75,5.76 18.72,6.73 18.72,7.89 U5.12
SW2
  Top 0.254: U5.13 19.56,6.77 19.38,6.59 19.38,6.5 19.38,6.35 19.33,6.29 19.33,4.81 SJ2.1
TX  (via drill 0.55, 0.55 pad 1.05)  (1 unrouted)
  Top 0.254: 17.12,16.17 U5.31 | U$7.ID 7.11,16.89 v7.39,16.6
  Top 0.305: U$5.RX 18.32,23.6 16.39,23.6 14.59,21.8 14.59,20.6 v15.09,20.1 16.19,20.1 16.61,19.69 16.61,19.32 17.09,18.83 | U$7.ID 6.27,16.89 6.29,16.9 | 17.09,18.83 17.09,18.8 | 17.09,18.83 17.14,18.78 17.14,16.17
  Bottom 0.305: v15.09,20.1 14.39,20.1 13.69,20.8 12.66,20.8 8.46,16.6 v7.39,16.6
VBATT  (via drill 0.55 pad 1.05)  (1 unrouted)
  Top 0.254: 6.87,11.13 6.86,11.11 6.8,11.05
  Top 0.406: R7.1 27.56,19.29 v28.62,19.29 | U$2.2 3.72,9.24 4.69,10.2 4.69,10.7 5.04,11.05 5.63,11.05 5.65,11.08 6.8,11.08 | v6.86,12.26 6.86,11.11 6.89,11.08 9.08,11.08 9.13,11.13 10.19,11.13 10.19,13.6 10.09,13.7 9.39,13.7 9.15,13.94 U3.3
  Bottom 0.305: v28.62,19.29 27.21,20.7 21.39,20.7 20.49,19.8 17.59,19.8 17.12,19.33 17.12,17.32 16.5,16.7 15.62,16.7 13.11,19.2 12.49,19.2 7.89,14.6 7.89,13 7.15,12.26 v6.86,12.26
  Bottom 0.406: U$2.2 5.11,9.24 7.65,6.69 7.65,3.65 9.77,1.52 J2.2
VCC  (via drill 0.55 pad 1.05)  (1 unrouted)
  Top 0.152: IC2.2 8.7,5.39
  Top 0.254: 15.04,10.89 U5.6 | 14.3,12.44 U5.4 | 23.24,10 U5.18
  Top 0.406: 27.55,10.7 v27.55,12.88 | U5.4 14.13,12.44 13.64,11.95 13.64,11.61 | 13.64,11.61 13.64,11.39 14.19,10.84 U5.6 18.83,10.84 19.63,10.05 23.2,10.05 23.24,10 | 13.58,11.55 12.73,11.55 12.7,11.52 12.7,9.12 11.09,7.5 10.43,7.5 IC2.2 | 13.58,11.55 13.64,11.61 | U5.18 26.88,10.03 27.55,10.7 | U$4.VDD 27.55,10.7 | 24.26,20.26 R5.1 | R5.1 24.1,20.91 24.89,21.7 25.69,21.7 26.54,22.55 U$5.VCC | U$4.VDD 27.94,7.23 R9.2 27.6,7.31 C10.1 | 32.29,2.75 U$3.VCC | U$4.VDD 30.65,7.59 30.65,7.56 31.49,6.72 31.49,6.04 32.57,4.96 C11.1 32.75,3.23 U$1.VIN | C4.1 13.58,11.66 13.58,11.55 | R5.1 24.1,17.2 24.16,17.14 24.16,17.01 v24.46,16.72
  Bottom 0.406: v24.46,16.72 27.55,13.43 v27.55,12.88
VUSB  (1 unrouted)
  Top 0.406: R2.1 8.95,21.74 8.95,20.4 | U$7.VCC 6.57,19.6 7.01,19.6 7.71,20.3 8.85,20.3 8.95,20.4 | 8.95,20.4 9.29,20.4 | 9.29,20.4 10.42,20.4 C12.1 | 9.29,20.4 9.29,18.12 9.01,17.84 9.01,16.63 8.65,16.26 8.65,16.16 8.09,15.6 8.09,14.42 8.06,14.39 8.06,12.46 8.86,12.46 9.1,12.22 9.1,12.44
XTAL1
  Top 0.406: Q1.1 10.83,2.67 C1.1 10.83,6.14 13.59,8.9 13.59,9.7 13.91,10.03 U5.7
XTAL2
  Top 0.406: Q1.2 15.72,3.39 C3.2 15.72,6.37 15.19,6.9 15.19,9.08 U5.8

### Text on the board
tValues: + | -